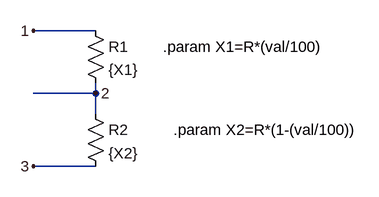
[diagram p0: schematic pot.asc]
pot.asc, the LTspice schematic file:
Version 4
SHEET 1 880 680
WIRE 176 32 80 32
WIRE 176 128 176 112
WIRE 176 128 80 128
WIRE 176 160 176 128
WIRE 176 240 80 240
FLAG 80 32 1
FLAG 176 128 2
FLAG 80 240 3
SYMBOL res 160 16 R0
SYMATTR InstName R1
SYMATTR Value {X1}
SYMBOL res 160 144 R0
SYMATTR InstName R2
SYMATTR Value {X2}
TEXT 280 56 Left 2 !.param X1=R*(val/100)
TEXT 296 184 Left 2 !.param X2=R*(1-(val/100))

The netlist it stands for:
* pot.asc
R1 1 2 {X1}
R2 2 3 {X2}
.param X1=R*(val/100)
.param X2=R*(1-(val/100))
.backanno
.end